# EAGLE design ModuleCarrier-EMW3166-v1.0.0 (EAGLE 7.7.0)

## Sheet 1 of 2
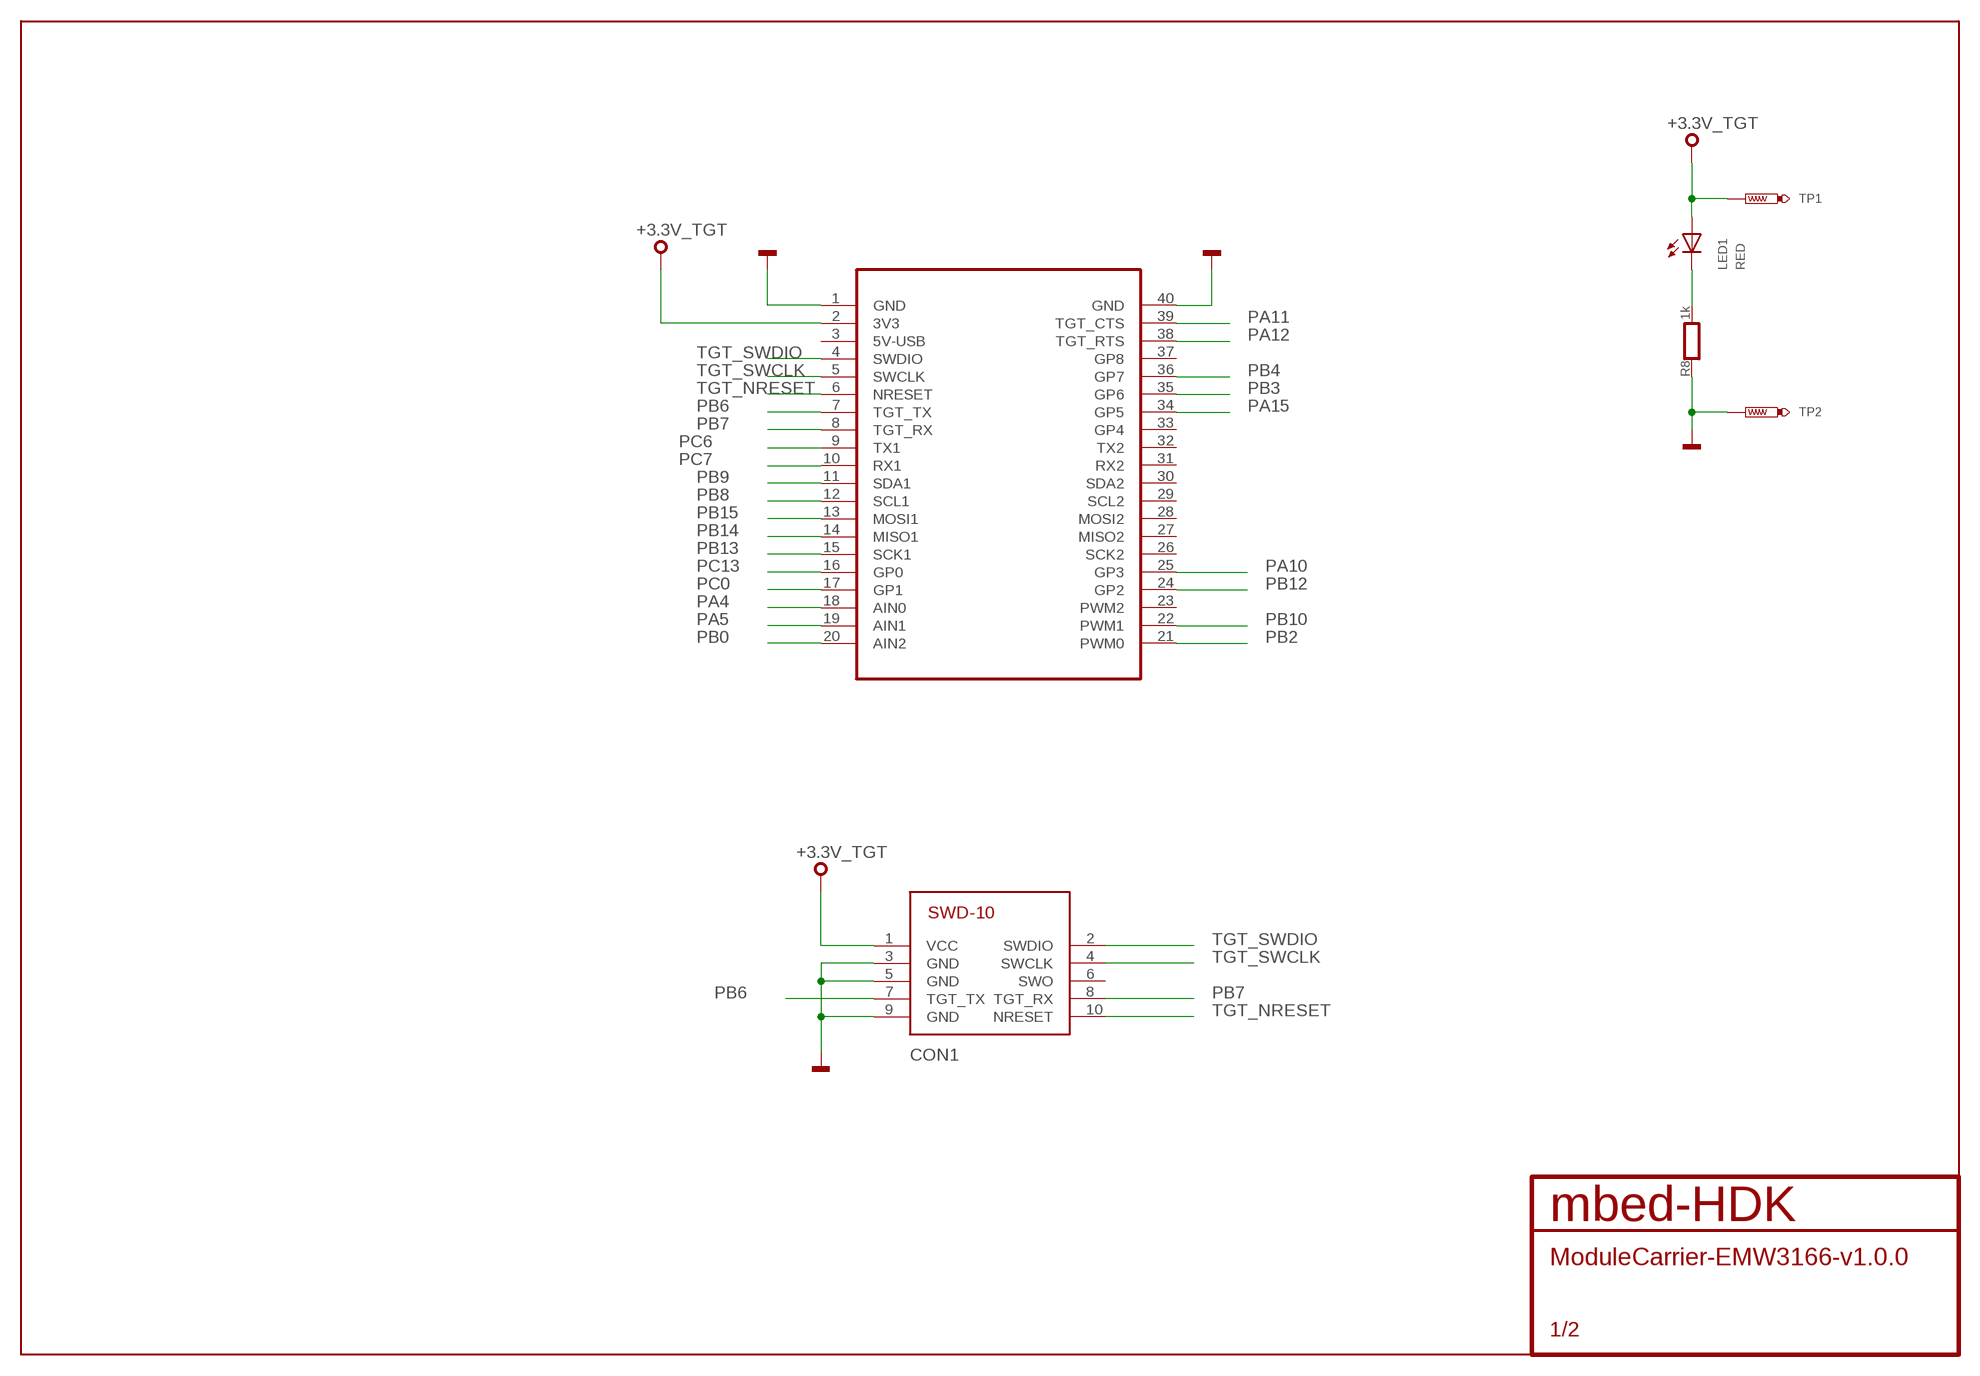
[diagram p0: schematic, sheet 1]

### Parts
CON1  SWD-10/TC2050_SMD  [FTSH-105-02]
LED1  RED  SMD_LED0603  [CHIPLED_0603]
R8  1k  RESISTOR0603  [0603]
TP1  TEST-POINT-50R-PTH  [TP50-PTH]
TP2  TEST-POINT-50R-PTH  [TP50-PTH]
U$1  MODULE_DAUGHTER  [MODULE_DAUGHTER]

### Nets
+3.3V_TGT: CON1.1(VCC) LED1.A TP1.TP U$1.2(3V3) ; also sheet 2
GND: CON1.3(GND) CON1.5(GND) CON1.9(GND) R8.1 TP2.TP U$1.1(GND) U$1.40(GND) ; also sheet 2
PA4: U$1.18(AIN0) ; also sheet 2
PA5: U$1.19(AIN1) ; also sheet 2
PA10: U$1.25(GP3) ; also sheet 2
PA11: U$1.39(TGT_CTS) ; also sheet 2
PA12: U$1.38(TGT_RTS) ; also sheet 2
PA15: U$1.34(GP5) ; also sheet 2
PA_1: LED1.C R8.2
PB0: U$1.20(AIN2) ; also sheet 2
PB2: U$1.21(PWM0) ; also sheet 2
PB3: U$1.35(GP6) ; also sheet 2
PB4: U$1.36(GP7) ; also sheet 2
PB6: CON1.7(TGT_TX) U$1.7(TGT_TX) ; also sheet 2
PB7: CON1.8(TGT_RX) U$1.8(TGT_RX) ; also sheet 2
PB8: U$1.12(SCL1) ; also sheet 2
PB9: U$1.11(SDA1) ; also sheet 2
PB10: U$1.22(PWM1) ; also sheet 2
PB12: U$1.24(GP2) ; also sheet 2
PB13: U$1.15(SCK1) ; also sheet 2
PB14: U$1.14(MISO1) ; also sheet 2
PB15: U$1.13(MOSI1) ; also sheet 2
PC0: U$1.17(GP1) ; also sheet 2
PC6: U$1.9(TX1) ; also sheet 2
PC7: U$1.10(RX1) ; also sheet 2
PC13: U$1.16(GP0) ; also sheet 2
TGT_NRESET: CON1.10(NRESET) U$1.6(NRESET) ; also sheet 2
TGT_SWCLK: CON1.4(SWCLK) U$1.5(SWCLK) ; also sheet 2
TGT_SWDIO: CON1.2(SWDIO) U$1.4(SWDIO) ; also sheet 2
Unconnected: CON1.6(SWO) U$1.3(5V-USB) U$1.23(PWM2) U$1.26(SCK2) U$1.27(MISO2) U$1.28(MOSI2) U$1.29(SCL2) U$1.30(SDA2) U$1.31(RX2) U$1.32(TX2) U$1.33(GP4) U$1.37(GP8)

## Sheet 2 of 2
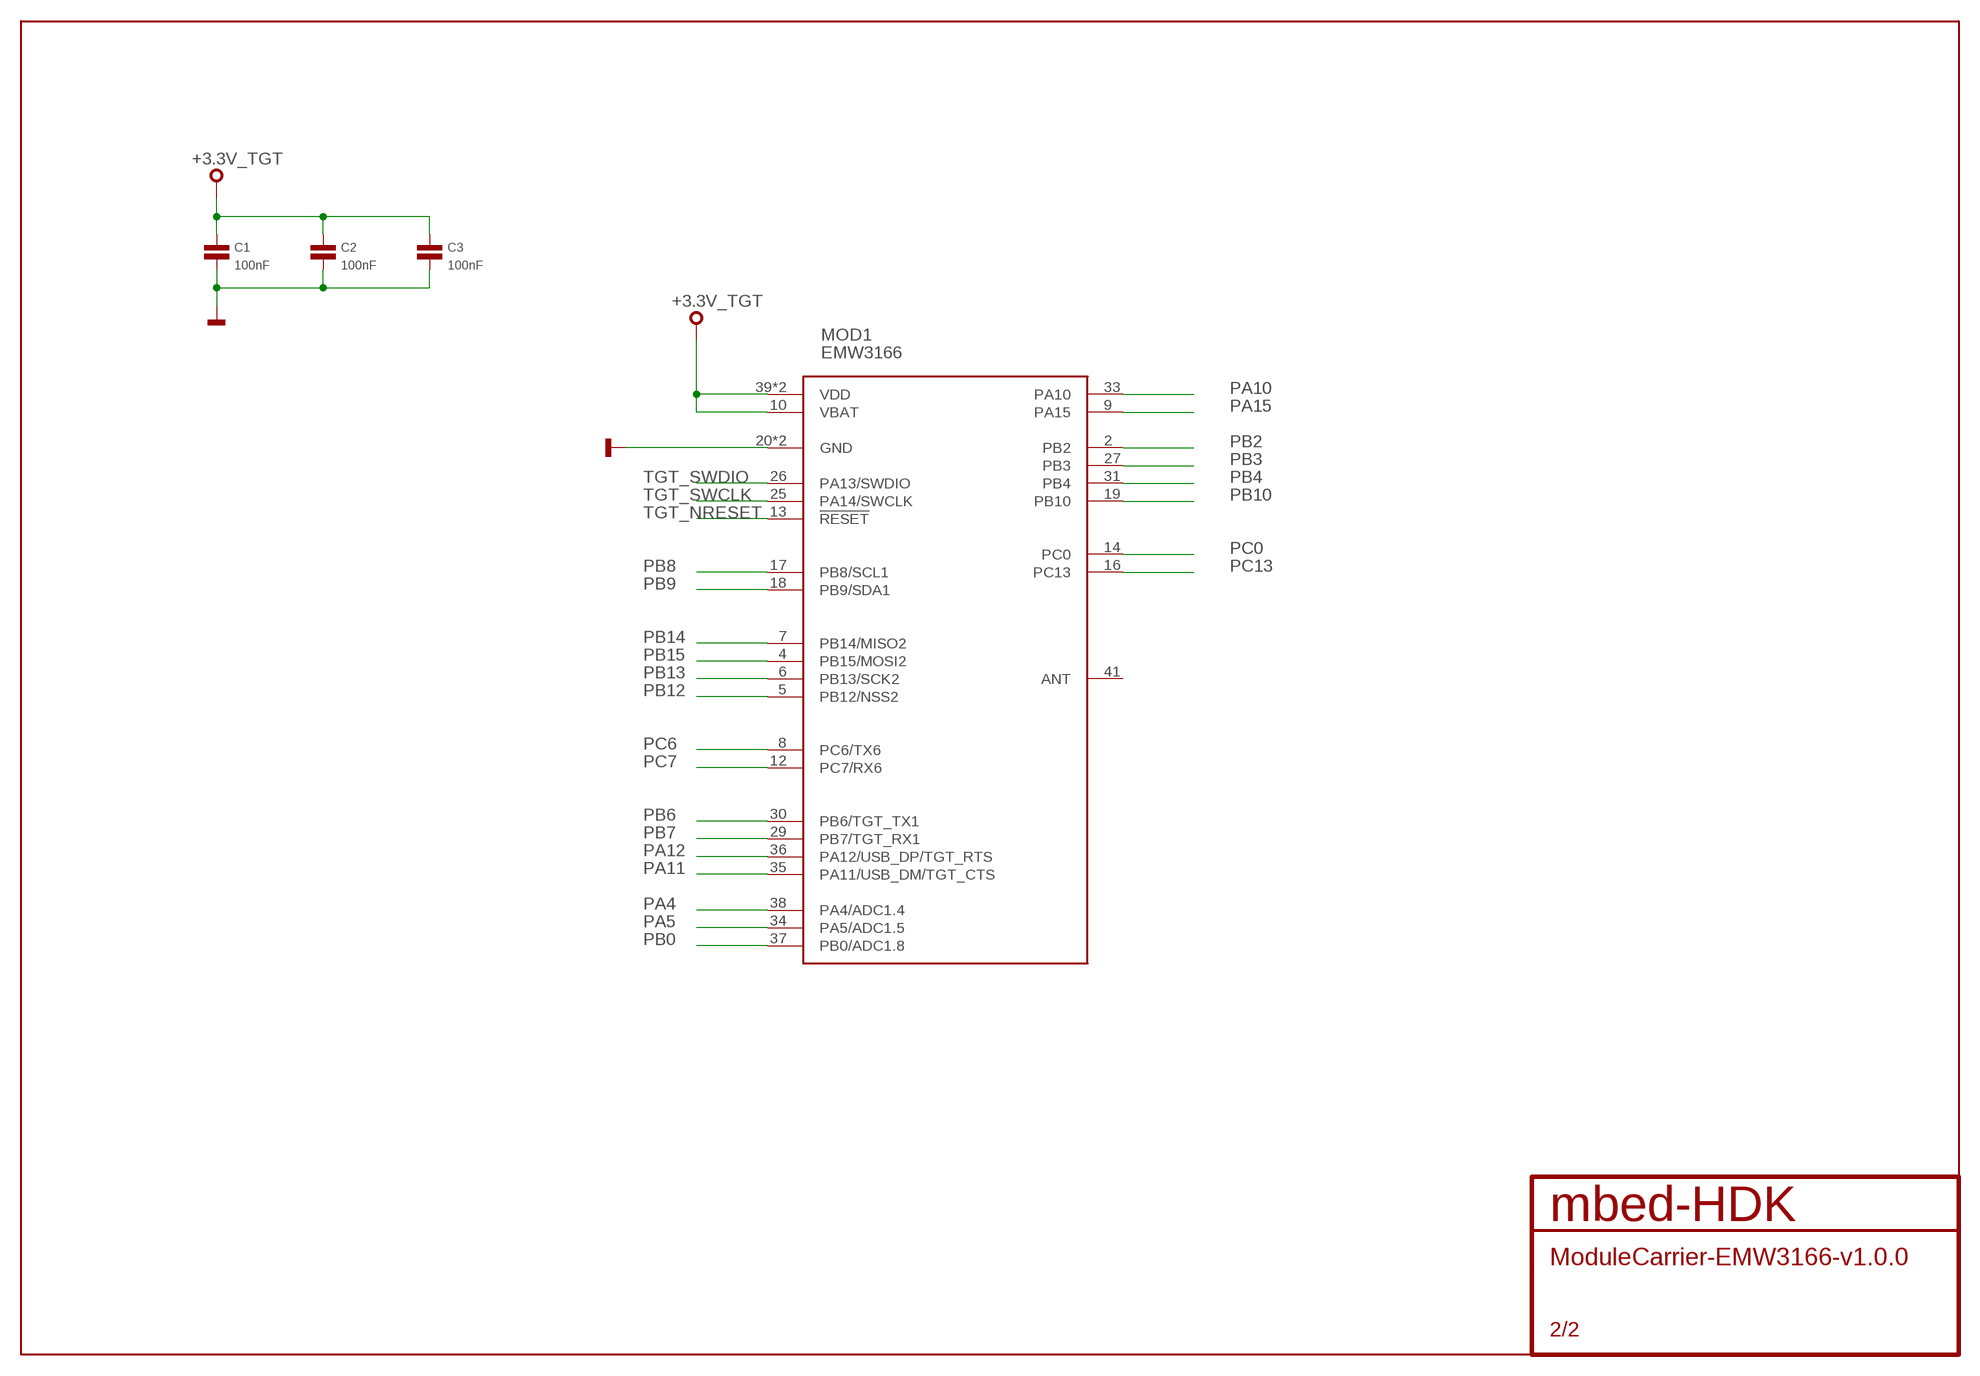
[diagram p1: schematic, sheet 2]

### Parts
C1  100nF  CAPACITOR0603  [0603]
C2  100nF  CAPACITOR0603  [0603]
C3  100nF  CAPACITOR0603  [0603]
MOD1  EMW3166  [EMW3166]

### Nets
+3.3V_TGT: C1.1 C2.1 C3.1 MOD1.10(VBAT) MOD1.39(VDD) MOD1.40(VDD) ; also sheet 1
GND: C1.2 C2.2 C3.2 MOD1.20(GND) MOD1.21(GND) ; also sheet 1
PA4: MOD1.38(PA4/ADC1.4) ; also sheet 1
PA5: MOD1.34(PA5/ADC1.5) ; also sheet 1
PA10: MOD1.33(PA10) ; also sheet 1
PA11: MOD1.35(PA11/USB_DM/TGT_CTS) ; also sheet 1
PA12: MOD1.36(PA12/USB_DP/TGT_RTS) ; also sheet 1
PA15: MOD1.9(PA15) ; also sheet 1
PB0: MOD1.37(PB0/ADC1.8) ; also sheet 1
PB2: MOD1.2(PB2) ; also sheet 1
PB3: MOD1.27(PB3) ; also sheet 1
PB4: MOD1.31(PB4) ; also sheet 1
PB6: MOD1.30(PB6/TGT_TX1) ; also sheet 1
PB7: MOD1.29(PB7/TGT_RX1) ; also sheet 1
PB8: MOD1.17(PB8/SCL1) ; also sheet 1
PB9: MOD1.18(PB9/SDA1) ; also sheet 1
PB10: MOD1.19(PB10) ; also sheet 1
PB12: MOD1.5(PB12/NSS2) ; also sheet 1
PB13: MOD1.6(PB13/SCK2) ; also sheet 1
PB14: MOD1.7(PB14/MISO2) ; also sheet 1
PB15: MOD1.4(PB15/MOSI2) ; also sheet 1
PC0: MOD1.14(PC0) ; also sheet 1
PC6: MOD1.8(PC6/TX6) ; also sheet 1
PC7: MOD1.12(PC7/RX6) ; also sheet 1
PC13: MOD1.16(PC13) ; also sheet 1
TGT_NRESET: MOD1.13(!RESET) ; also sheet 1
TGT_SWCLK: MOD1.25(PA14/SWCLK) ; also sheet 1
TGT_SWDIO: MOD1.26(PA13/SWDIO) ; also sheet 1
Unconnected: MOD1.41(ANT)

## Library data of the parts
C1-C3 = mbed-HDK-RLC:CAPACITOR: Capacitor
CON1 = mbed-HDK-Connector:SWD-10/TC2050: 1mm pitch 10-Pin Cortex Programming Header with optional TC2050 footprint solderless interchangeable
LED1 = mbed-HDK-Optical:SMD_LED: LED SMD, Colour Red; MF: Wurth Electronics Inc; MFN: 150060RS75000; OC-DIGIKEY: 732-4978-1-ND; OC-MOUSER: 710-150060RS75000; OC-NEWARK: 2322071
MOD1 = blackbriar:EMW3166
R8 = mbed-HDK-RLC:RESISTOR: Resistor
TP1 TP2 = mbed-HDK:TEST-POINT
U$1 = Treadstone:MODULE_DAUGHTER

## Board
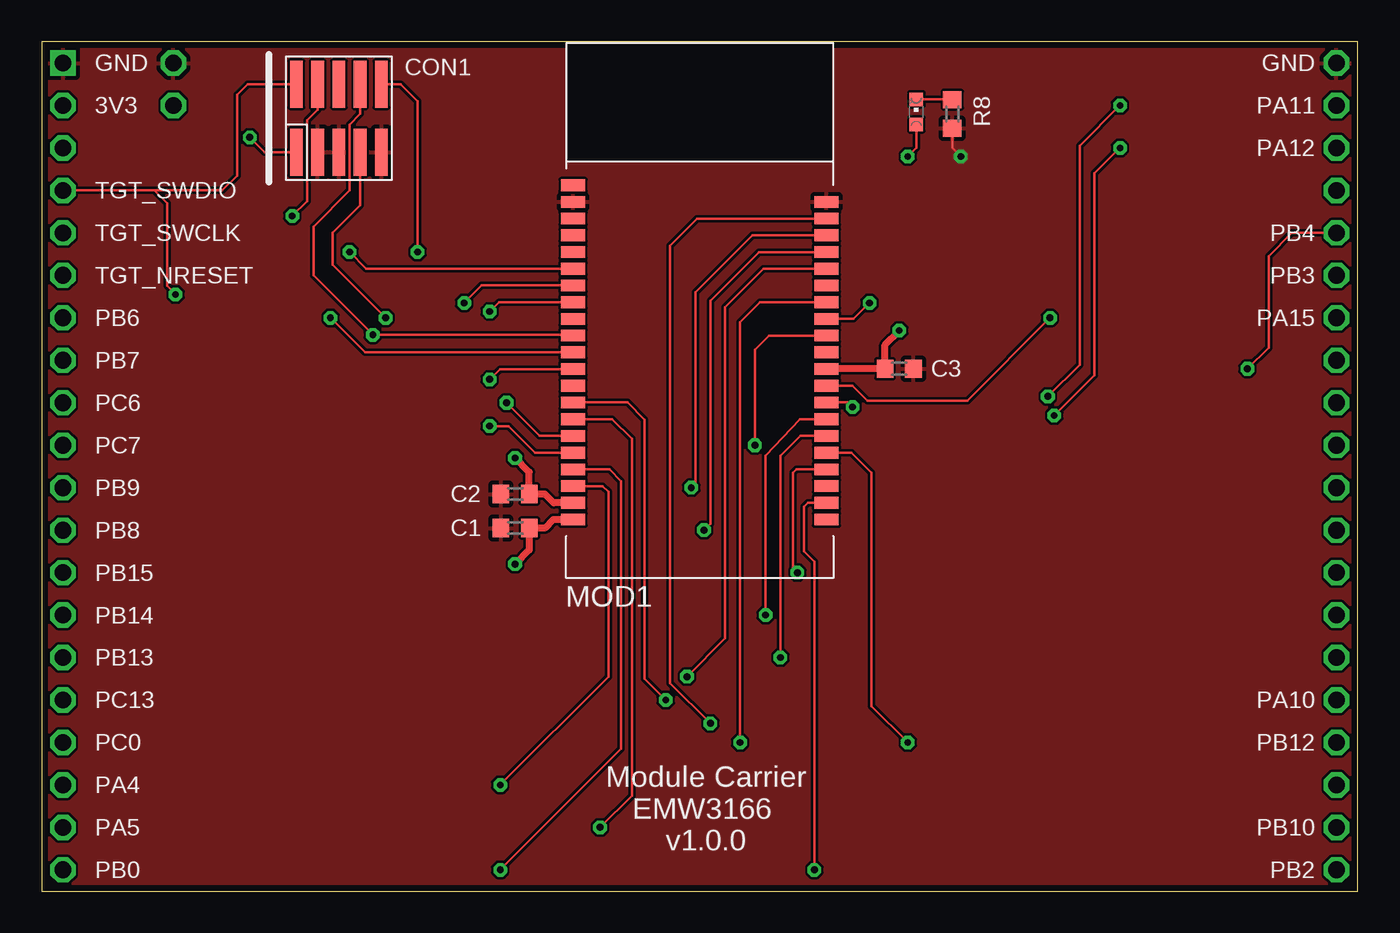
[diagram p2: board, top side]
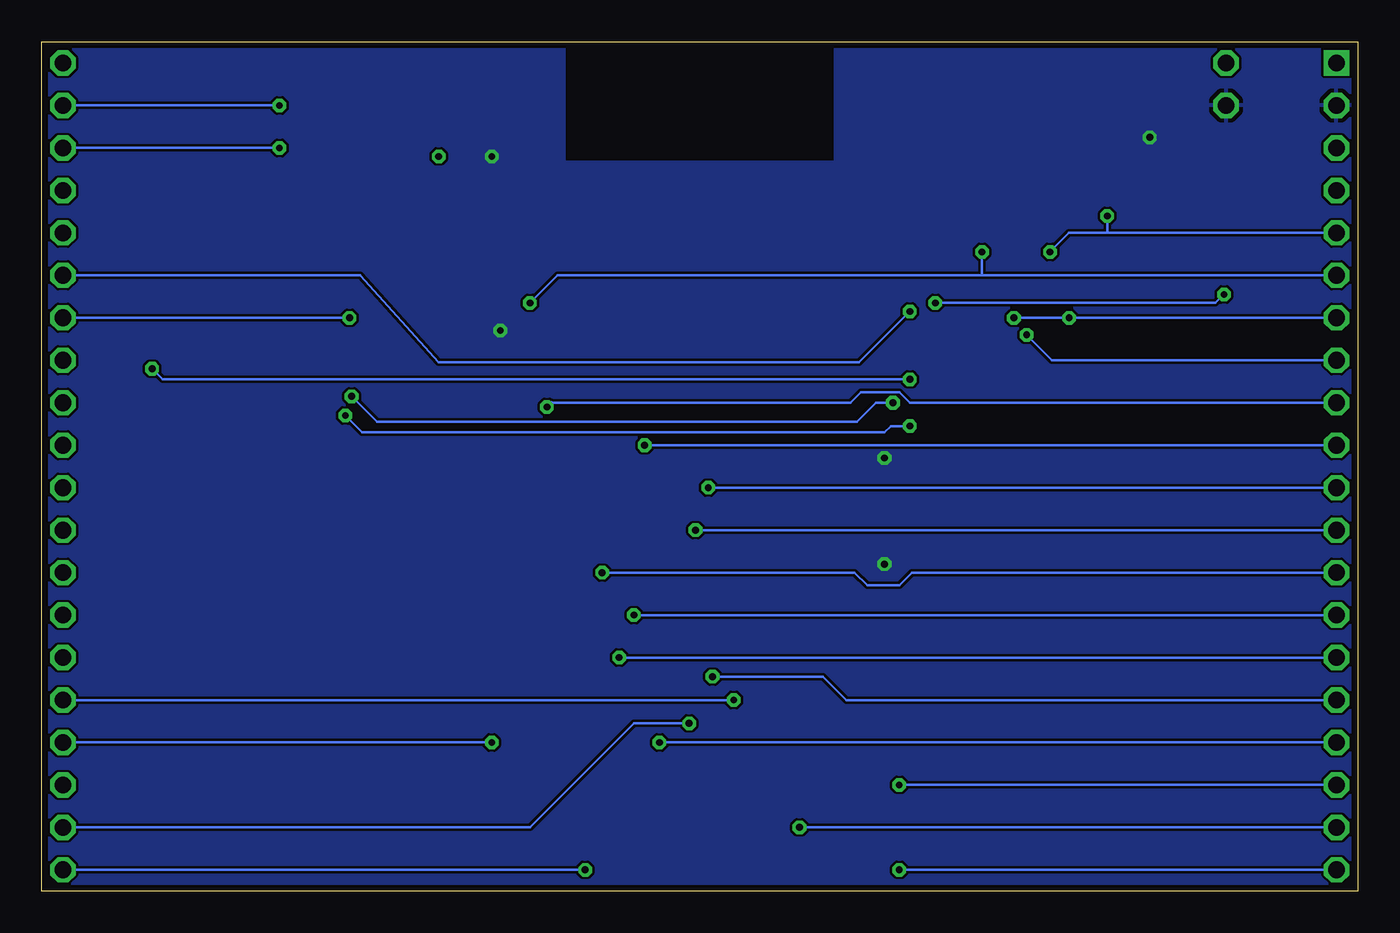
[diagram p3: board, bottom side, seen from below]

Size 78.74 x 50.8 mm. Coordinates in mm from the lower left corner, seen from the top.
Copper layers ((1*16)): Top 0.035mm / dielectric 0.8mm / Bottom 0.035mm
Design rules "mbed-HDK-6-6-2-layer": minimum track width 6mil, minimum drill 9mil, track to track 6mil, track to pad 6mil, pad to pad 6mil, via to via 6mil, smd to smd 6mil, copper to edge 15mil, drill to drill 8mil, minimum pad ring 10mil, minimum via ring 8mil, stop-mask expansion 4mil, vias tented up to drill 0mil, thermal gap 10mil

### Footprints (pad centres in the part's own frame; a part is rotated, then mirrored left to right if it is on the bottom)
0603 = smd 1 x 1.1: 1 -0.85,0; 2 0.85,0
FTSH-105-02 = smd 0.762 x 2.794: 1 0.381,-2.032; 2 0.381,2.032; 3 1.651,-2.032; 4 1.651,2.032; 5 2.921,-2.032; 6 2.921,2.032; 7 4.191,-2.032; 8 4.191,2.032; 9 5.461,-2.032; 10 5.461,2.032
CHIPLED_0603 = smd 0.8 x 0.8: A 0,-0.75; C 0,0.75
EMW3166 = smd 0.7 x 1.45: 1 0,7.585; 2 -1,7.585; 3 -2,7.585; 4 -3,7.585; 5 -4,7.585; 6 -5,7.585; 7 -6,7.585; 8 -7,7.585; 9 -8,7.585; 10 -9,7.585; 11 -10,7.585; 12 -11,7.585; 13 -12,7.585; 14 -13,7.585; 15 -14,7.585; 16 -15,7.585; 17 -16,7.585; 18 -17,7.585; 19 -18,7.585; 20 -19,7.585; 21 -19,-7.585; 22 -18,-7.585; 23 -17,-7.585; 24 -16,-7.585; 25 -15,-7.585; 26 -14,-7.585; 27 -13,-7.585; 28 -12,-7.585; 29 -11,-7.585; 30 -10,-7.585; 31 -9,-7.585; 32 -8,-7.585; 33 -7,-7.585; 34 -6,-7.585; 35 -5,-7.585; 36 -4,-7.585; 37 -3,-7.585; 38 -2,-7.585; 39 -1,-7.585; 40 0,-7.585; 41 -20,-7.585
TP50-PTH = drill 1 octagon: TP 0,0
MODULE_DAUGHTER = drill 1 square: 1 0,0 | drill 1 octagon: 2 0,-2.54; 3 0,-5.08; 4 0,-7.62; 5 0,-10.16; 6 0,-12.7; 7 0,-15.24; 8 0,-17.78; 9 0,-20.32; 10 0,-22.86; 11 0,-25.4; 12 0,-27.94; 13 0,-30.48; 14 0,-33.02; 15 0,-35.56; 16 0,-38.1; 17 0,-40.64; 18 0,-43.18; 19 0,-45.72; 20 0,-48.26; 21 76.2,-48.26; 22 76.2,-45.72; 23 76.2,-43.18; 24 76.2,-40.64; 25 76.2,-38.1; 26 76.2,-35.56; 27 76.2,-33.02; 28 76.2,-30.48; 29 76.2,-27.94; 30 76.2,-25.4; 31 76.2,-22.86; 32 76.2,-20.32; 33 76.2,-17.78; 34 76.2,-15.24; 35 76.2,-12.7; 36 76.2,-10.16; 37 76.2,-7.62; 38 76.2,-5.08; 39 76.2,-2.54; 40 76.2,0

### Placement (x,y rotation side)
C1  28.32,21.72 180 top
C2  28.32,23.75 180 top
C3  51.31,31.24 0 top
CON1  14.86,46.23 0 top
LED1  52.32,46.61 0 top
MOD1  39.37,22.23 270 top
R8  54.48,46.48 90 top
TP1  7.87,46.99 0 top
TP2  7.87,49.53 0 top
U$1  1.27,49.53 0 top

### Tracks (layer width: path | path; a pad name or v marks a point on that pad's centre or on a via)
+3.3V_TGT  (via drill 0.41)
  Top 0.152: CON1.1 13.34,44.2 v12.45,45.09 | LED1.A 52.32,44.45 v51.82,43.94
  Top 0.406: MOD1.40 30.61,22.23 30.1,21.72 C1.1 29.17,20.41 v28.32,19.56 | MOD1.39 30.62,23.23 30.1,23.75 C2.1 29.17,25.06 v28.32,25.91 | v51.31,33.53 50.46,32.68 C3.1 46.97,31.24 MOD1.10
  pour Bottom: 0,0 78.74,0 78.74,50.8 0,50.8
GND  (via drill 0.41)
  Top 0.152: R8.1 54.48,44.45 v54.99,43.94
  pour Top: 0,0 78.74,0 78.74,50.8 0,50.8
PA4  (via drill 0.41)
  Top 0.152: MOD1.38 33.56,24.23 33.91,23.88 33.91,12.83 v27.43,6.35
  Bottom 0.152: v27.43,6.35 U$1.18
PA5  (via drill 0.41)
  Top 0.152: MOD1.34 34.13,28.23 35.31,27.05 35.31,5.71 v33.4,3.81
  Bottom 0.152: v33.4,3.81 U$1.19
PA10  (via drill 0.41)
  Top 0.152: MOD1.33 35.04,29.23 36.07,28.19 36.07,12.7 v37.34,11.43
  Bottom 0.152: v37.34,11.43 U$1.25
PA11  (via drill 0.41)
  Top 0.152: MOD1.35 29.8,27.23 v27.81,29.21 | v60.2,29.59 62.1,31.5 62.1,44.58 v64.52,46.99
  Bottom 0.152: v27.81,29.21 28.83,29.21 29.97,28.07 58.67,28.07 v60.2,29.59 | v64.52,46.99 U$1.39
PA12  (via drill 0.41)
  Top 0.152: MOD1.36 29.53,26.23 27.94,27.81 v26.8,27.81 | v60.58,28.45 62.99,30.86 62.99,42.93 v64.52,44.45
  Bottom 0.152: v26.8,27.81 27.94,27.81 28.32,27.43 59.56,27.43 v60.58,28.45 | U$1.38 v64.52,44.45
PA15  (via drill 0.41)
  Top 0.152: MOD1.9 48.52,30.23 49.4,29.34 55.37,29.34 v60.33,34.29
  Bottom 0.152: v60.33,34.29 U$1.34
PA_1
  Top 0.152: LED1.C 54.46,47.36 R8.2
PB0  (via drill 0.41)
  Top 0.152: MOD1.37 33.96,25.23 34.67,24.51 34.67,8.51 v27.43,1.27
  Bottom 0.152: v27.43,1.27 U$1.20
PB2  (via drill 0.41)
  Top 0.152: MOD1.2 45.83,23.23 45.59,22.99 45.59,20.32 46.23,19.68 v46.23,1.27
  Bottom 0.152: v46.23,1.27 U$1.21
PB3  (via drill 0.41)
  Top 0.152: MOD1.27 27.35,35.23 v26.8,34.67
  Bottom 0.152: U$1.35 59.69,36.83 54.99,31.62 29.84,31.62 v26.8,34.67
PB4  (via drill 0.41)
  Top 0.152: MOD1.31 27.41,31.23 v26.8,30.61 | U$1.36 74.8,39.37 73.41,37.97 73.41,32.51 v72.14,31.24
  Bottom 0.152: v72.14,31.24 71.5,30.61 v26.8,30.61
PB6  (via drill 0.41)
  Top 0.152: MOD1.30 19.34,32.23 v17.27,34.29 | CON1.7 19.05,41.02 17.4,39.37 17.4,37.47 v20.57,34.29
  Bottom 0.152: U$1.7 v17.27,34.29 v20.57,34.29
PB7  (via drill 0.41)
  Top 0.152: MOD1.29 31.74,33.27 v19.81,33.27 16.26,36.83 16.26,39.75 18.41,41.91 18.41,45.85 19.05,46.48 CON1.8
  Bottom 0.152: v19.81,33.27 18.29,31.75 U$1.8
PB8  (via drill 0.41)
  Top 0.152: MOD1.17 42.92,38.23 40.01,35.31 40.01,21.97 v39.62,21.59
  Bottom 0.152: U$1.12 v39.62,21.59
PB9  (via drill 0.41)
  Top 0.152: MOD1.18 42.53,39.23 39.12,35.81 39.12,24.38 v38.86,24.13
  Bottom 0.152: U$1.11 v38.86,24.13
PB10  (via drill 0.41)
  Top 0.152: v40.01,10.03 37.59,12.45 37.59,38.61 39.21,40.23 MOD1.19
  Bottom 0.152: v40.01,10.03 43.31,10.03 49.53,3.81 U$1.22
PB12  (via drill 0.41)
  Top 0.152: MOD1.5 48.45,26.23 49.66,25.02 49.66,11.05 v51.82,8.89
  Bottom 0.152: v51.82,8.89 U$1.24
PB13  (via drill 0.41)
  Top 0.152: MOD1.6 45.39,27.23 44.2,26.04 v44.2,13.97
  Bottom 0.152: v44.2,13.97 U$1.15
PB14  (via drill 0.41)
  Top 0.152: MOD1.7 45.37,28.23 43.31,26.04 v43.31,16.51
  Bottom 0.152: v43.31,16.51 U$1.14
PB15  (via drill 0.41)
  Top 0.152: MOD1.4 45.16,25.23 44.96,25.02 44.96,19.3 v45.21,19.05
  Bottom 0.152: U$1.13 26.67,19.05 27.43,18.29 29.34,18.29 30.1,19.05 v45.21,19.05
PC0  (via drill 0.41)
  Top 0.152: MOD1.14 42.97,35.23 41.78,34.04 v41.78,8.89
  Bottom 0.152: U$1.17 v41.78,8.89
PC6  (via drill 0.41)
  Top 0.152: MOD1.8 48.24,29.23 v48.51,28.96
  Bottom 0.152: U$1.9 26.8,29.21 27.43,29.84 29.72,29.84 30.35,29.21 48.26,29.21 v48.51,28.96 48.24,29.23
PC7  (via drill 0.41)
  Top 0.152: MOD1.12 43.51,33.23 42.67,32.38 v42.67,26.67
  Bottom 0.152: v42.67,26.67 U$1.10
PC13  (via drill 0.41)
  Top 0.152: MOD1.16 43.19,37.23 40.89,34.92 40.89,15.11 v38.61,12.83
  Bottom 0.152: v38.61,12.83 32,12.83 30.61,11.43 U$1.16
TGT_NRESET  (via drill 0.41)
  Top 0.152: MOD1.13 48.58,34.23 v49.53,35.18 | CON1.10 21.46,48.26 22.48,47.24 v22.48,38.23
  Bottom 0.152: U$1.6 22.48,36.83 | 22.48,36.83 47.88,36.83 v49.53,35.18 | v22.48,38.23 22.48,36.83
TGT_SWCLK  (via drill 0.41)
  Top 0.152: MOD1.25 19.42,37.23 v18.41,38.23 | CON1.4 16.51,46.74 15.88,46.1 15.88,41.27 v14.99,40.39
  Bottom 0.152: v18.41,38.23 17.27,39.37 14.99,39.37 | 14.99,39.37 U$1.5 | v14.99,40.39 14.99,39.37
TGT_SWDIO  (via drill 0.41)
  Top 0.152: 6.73,41.91 U$1.4 | MOD1.26 26.32,36.23 v25.27,35.18 | v8,35.69 7.49,36.2 7.49,41.15 6.73,41.91 | CON1.2 12.32,48.26 11.68,47.62 11.68,42.8 10.79,41.91 6.73,41.91
  Bottom 0.152: v25.27,35.18 8.51,35.18 v8,35.69

### Text on the board
tPlace: GND / 3V3 / / TGT_SWDIO / TGT_SWCLK / TGT_NRESET / PB6 / PB7 / PC6 / PC7 / PB9 / PB8 / PB15 / PB14 / PB13 / PC13 / PC0 / PA4 / PA5 / PB0 | GND / PA11 / PA12 / / PB4 / PB3 / PA15 / / / / / / / / / PA10 / PB12 / / PB10 / PB2 | Module Carrier / EMW3166 / v1.0.0